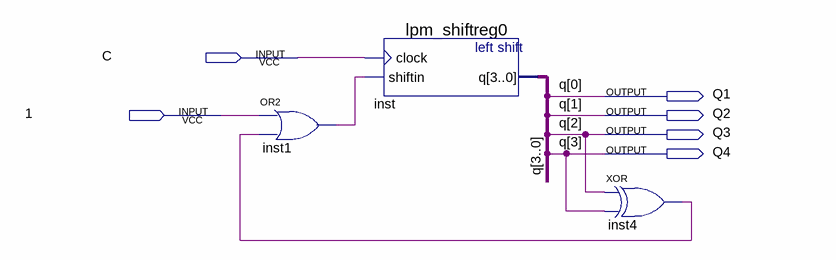
[diagram p0: schematic sheet]
// Quartus schematic v1z2.bdf as structural Verilog: 3 symbols, 6 pins
module v1z2 (
  input  C,
  input  \1 ,
  output Q1,
  output Q2,
  output Q3,
  output Q4
);

  wire inst1_out, inst4_out;

  or inst1 (inst1_out, \1 , inst4_out);
  lpm_shiftreg0 inst (.clock(C), .shiftin(inst1_out), .q({4{Q1}}));
  xor inst4 (inst4_out, Q1, Q1);

  assign Q2 = Q1;
  assign Q3 = Q1;
  assign Q4 = Q1;

  // Other names for the same wires on the sheet: q (some bits) = {3{Q1}}
endmodule
